# EAGLE schematic ir_receiver (EAGLE 9.7.0)
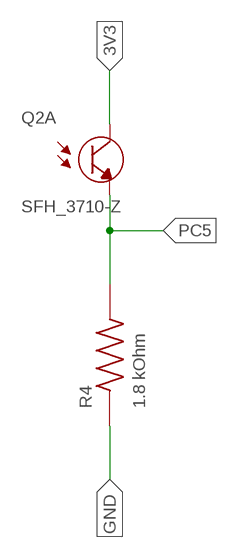
[diagram p0: schematic, sheet 1]

## Parts
Q2A  SFH_3710-Z  [TRANS_SFH_3710-Z]
R4  1.8 kOhm  RMCF0805JT1K80  [RESC2012X65N]

## Nets
3V3: Q2A.1(C)
GND: R4.1
PC5: Q2A.2(E) R4.2

## Library data of the parts
Q2A = Phototransistor:SFH_3710-Z: CHIPLED®, Silicon NPN Phototransistor with Vλ Characteristics; CHECK_PRICES: https://www.snapeda.com/parts/SFH%203710-Z/OSRAM+Opto+Semiconductors+Inc./view-part/?ref=eda; DESCRIPTION: Phototransistors 570nm Top View 0805 (2012 Metric); DIGIKEY_PART_NUMBER: 475-SFH3710-ZTR-ND; MF: OSRAM Opto; MP: SFH 3710-Z; PACKAGE: 0805 Osram Opto; SNAPEDA_LINK: https://www.snapeda.com/parts/SFH%203710-Z/OSRAM+Opto+Semiconductors+Inc./view-part/?ref=snap
R4 = Resistor1.8kOhms:RMCF0805JT1K80; CHECK_PRICES: https://www.snapeda.com/parts/RMCF0805JT1K80/Stackpole+Electronics+Inc/view-part/?ref=eda; DESCRIPTION: 1.8 kOhms ±5% 0.125W, 1/8W Chip Resistor 0805 (2012 Metric) Automotive AEC-Q200 Thick Film; DIGIKEY_PART_NUMBER: RMCF0805JT1K80TR-ND; MF: Stackpole Electronics Inc; MP: RMCF0805JT1K80; PACKAGE: 2012 Stackpole; PURCHASE-URL: https://www.snapeda.com/api/url_track_click_mouser/?unipart_id=3950781&manufacturer=Stackpole Electronics Inc&part_name=RMCF0805JT1K80&search_term=None; SNAPEDA_LINK: https://www.snapeda.com/parts/RMCF0805JT1K80/Stackpole+Electronics+Inc/view-part/?ref=snap